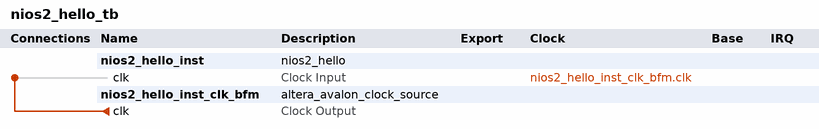
[diagram p0: system contents]
# Platform Designer (Qsys) system nios2_hello_tb, Cyclone V 5CSEMA4U23C6
# Parameters at their usual value, and those the tool derives, are not listed.
package require -exact qsys 18.1
create_system nios2_hello_tb
set_project_property DEVICE_FAMILY {Cyclone V}
set_project_property DEVICE 5CSEMA4U23C6

add_instance nios2_hello_inst nios2_hello 1.0

add_instance nios2_hello_inst_clk_bfm altera_avalon_clock_source 18.1

# connections
add_connection nios2_hello_inst_clk_bfm.clk nios2_hello_inst.clk clock

set_interconnect_requirement {$system} qsys_mm.clockCrossingAdapter HANDSHAKE
set_interconnect_requirement {$system} qsys_mm.enableEccProtection FALSE
set_interconnect_requirement {$system} qsys_mm.insertDefaultSlave FALSE
set_interconnect_requirement {$system} qsys_mm.maxAdditionalLatency 1

save_system nios2_hello_tb.qsys
